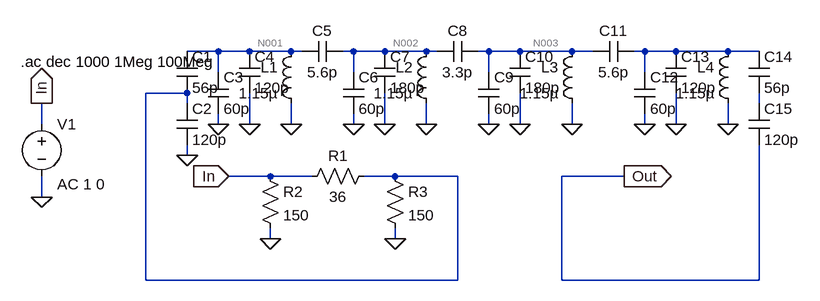
[diagram p0: schematic 300khz bandwith 10mhz LC filter.asc]
300khz bandwith 10mhz LC filter.asc, the LTspice schematic file:
Version 4
SHEET 1 932 680
WIRE 0 -16 -48 -16
WIRE 48 -16 0 -16
WIRE 112 -16 48 -16
WIRE 128 -16 112 -16
WIRE 208 -16 192 -16
WIRE 256 -16 208 -16
WIRE 320 -16 256 -16
WIRE 336 -16 320 -16
WIRE 416 -16 400 -16
WIRE 464 -16 416 -16
WIRE 544 -16 464 -16
WIRE 576 -16 544 -16
WIRE 656 -16 640 -16
WIRE 704 -16 656 -16
WIRE 784 -16 704 -16
WIRE 832 -16 784 -16
WIRE 0 16 0 -16
WIRE 208 16 208 -16
WIRE 416 16 416 -16
WIRE 656 16 656 -16
WIRE -48 48 -112 48
WIRE -48 64 -48 48
WIRE 832 64 832 48
WIRE -272 96 -272 64
WIRE 0 96 0 80
WIRE 48 96 48 48
WIRE 112 96 112 64
WIRE 208 96 208 80
WIRE 256 96 256 48
WIRE 320 96 320 64
WIRE 416 96 416 80
WIRE 464 96 464 48
WIRE 544 96 544 64
WIRE 656 96 656 80
WIRE 704 96 704 48
WIRE 784 96 784 64
WIRE -48 144 -48 128
WIRE 80 176 16 176
WIRE 144 176 80 176
WIRE 272 176 224 176
WIRE 368 176 272 176
WIRE 624 176 528 176
WIRE -272 208 -272 176
WIRE 80 272 80 256
WIRE 272 272 272 256
WIRE -112 336 -112 48
WIRE 368 336 368 176
WIRE 368 336 -112 336
WIRE 528 336 528 176
WIRE 832 336 832 128
WIRE 832 336 528 336
FLAG 16 176 In
IOPIN 16 176 In
FLAG 80 272 0
FLAG 272 272 0
FLAG -48 144 0
FLAG 0 96 0
FLAG 48 96 0
FLAG 112 96 0
FLAG 208 96 0
FLAG 256 96 0
FLAG 320 96 0
FLAG 624 176 Out
IOPIN 624 176 Out
FLAG -272 208 0
FLAG 416 96 0
FLAG 464 96 0
FLAG 544 96 0
FLAG 656 96 0
FLAG 704 96 0
FLAG 784 96 0
FLAG -272 64 In
IOPIN -272 64 Out
SYMBOL cap -64 -16 R0
SYMATTR InstName C1
SYMATTR Value 56p
SYMBOL cap -64 64 R0
SYMATTR InstName C2
SYMATTR Value 120p
SYMBOL cap -16 16 R0
SYMATTR InstName C3
SYMATTR Value 60p
SYMBOL cap 32 -16 R0
SYMATTR InstName C4
SYMATTR Value 120p
SYMBOL cap 192 -32 R90
WINDOW 0 0 32 VBottom 2
WINDOW 3 32 32 VTop 2
SYMATTR InstName C5
SYMATTR Value 5.6p
SYMBOL cap 192 16 R0
SYMATTR InstName C6
SYMATTR Value 60p
SYMBOL cap 240 -16 R0
SYMATTR InstName C7
SYMATTR Value 180p
SYMBOL cap 400 -32 R90
WINDOW 0 0 32 VBottom 2
WINDOW 3 32 32 VTop 2
SYMATTR InstName C8
SYMATTR Value 3.3p
SYMBOL cap 400 16 R0
SYMATTR InstName C9
SYMATTR Value 60p
SYMBOL cap 448 -16 R0
SYMATTR InstName C10
SYMATTR Value 180p
SYMBOL cap 640 -32 R90
WINDOW 0 0 32 VBottom 2
WINDOW 3 32 32 VTop 2
SYMATTR InstName C11
SYMATTR Value 5.6p
SYMBOL cap 640 16 R0
SYMATTR InstName C12
SYMATTR Value 60p
SYMBOL cap 688 -16 R0
SYMATTR InstName C13
SYMATTR Value 120p
SYMBOL cap 816 -16 R0
SYMATTR InstName C14
SYMATTR Value 56p
SYMBOL cap 816 64 R0
SYMATTR InstName C15
SYMATTR Value 120p
SYMBOL res 240 160 R90
WINDOW 0 0 56 VBottom 2
WINDOW 3 32 56 VTop 2
SYMATTR InstName R1
SYMATTR Value 36
SYMBOL res 64 160 R0
SYMATTR InstName R2
SYMATTR Value 150
SYMBOL res 256 160 R0
SYMATTR InstName R3
SYMATTR Value 150
SYMBOL ind 128 -32 M0
SYMATTR InstName L1
SYMATTR Value 1.15µ
SYMBOL ind 336 -32 M0
SYMATTR InstName L2
SYMATTR Value 1.15µ
SYMBOL ind 560 -32 M0
SYMATTR InstName L3
SYMATTR Value 1.15µ
SYMBOL ind 800 -32 M0
SYMATTR InstName L4
SYMATTR Value 1.15µ
SYMBOL voltage -272 80 R0
WINDOW 123 24 108 Left 2
WINDOW 39 0 0 Left 0
SYMATTR InstName V1
SYMATTR Value ""
SYMATTR Value2 AC 1 0
TEXT -304 0 Left 2 !.ac dec 1000 1Meg 100Meg

The netlist it stands for:
* 300khz bandwith 10mhz LC filter.asc
C1 N001 N005 56p
C2 N005 0 120p
C3 N001 0 60p
C4 N001 0 120p
C5 N002 N001 5.6p
C6 N002 0 60p
C7 N002 0 180p
C8 N003 N002 3.3p
C9 N003 0 60p
C10 N003 0 180p
C11 N004 N003 5.6p
C12 N004 0 60p
C13 N004 0 120p
C14 N004 N006 56p
C15 N006 Out 120p
R1 N005 In 36
R2 In 0 150
R3 N005 0 150
L1 N001 0 1.15µ
L2 N002 0 1.15µ
L3 N003 0 1.15µ
L4 N004 0 1.15µ
V1 In 0 AC 1 0
.ac dec 1000 1Meg 100Meg
.backanno
.end

* Results of the author's LTspice run, read from the files saved beside the schematic
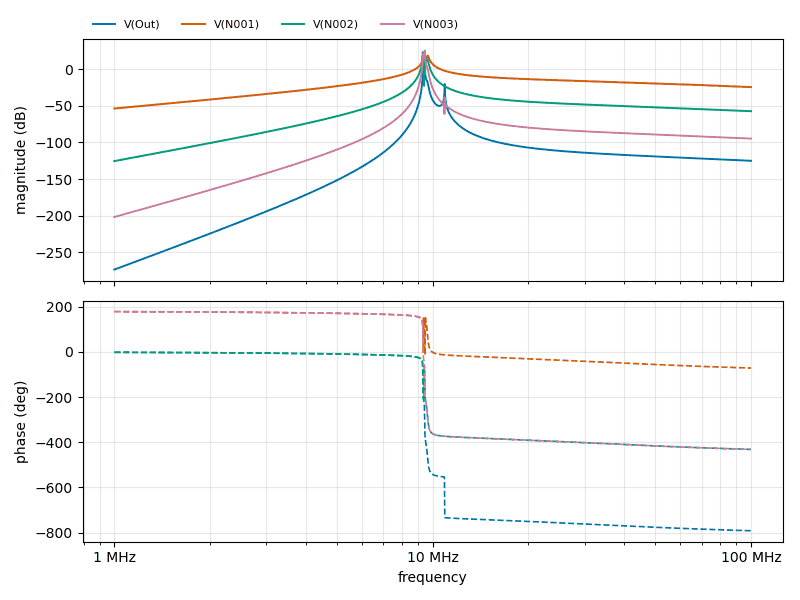
[diagram p1: AC Analysis of 300khz bandwith 10mhz LC filter.asc, plotted from the saved traces]
* AC Analysis, 1 run:
*   V(Out): -273.68 dB at 1 MHz, -125.06 dB at 100 MHz, peak 4.93 dB at 9.441 MHz, 3 dB below the peak at 9.427 MHz and 9.449 MHz
*   V(N001): -53.67 dB at 1 MHz, -24.41 dB at 100 MHz, peak 18.66 dB at 9.638 MHz, 3 dB below the peak at 9.567 MHz and 9.723 MHz
*   V(N002): -125.47 dB at 1 MHz, -57.29 dB at 100 MHz, peak 23.45 dB at 9.311 MHz, 3 dB below the peak at 9.303 MHz and 9.335 MHz
*   V(N003): -201.86 dB at 1 MHz, -94.75 dB at 100 MHz, peak 25.75 dB at 9.441 MHz, 3 dB below the peak at 9.426 MHz and 9.449 MHz